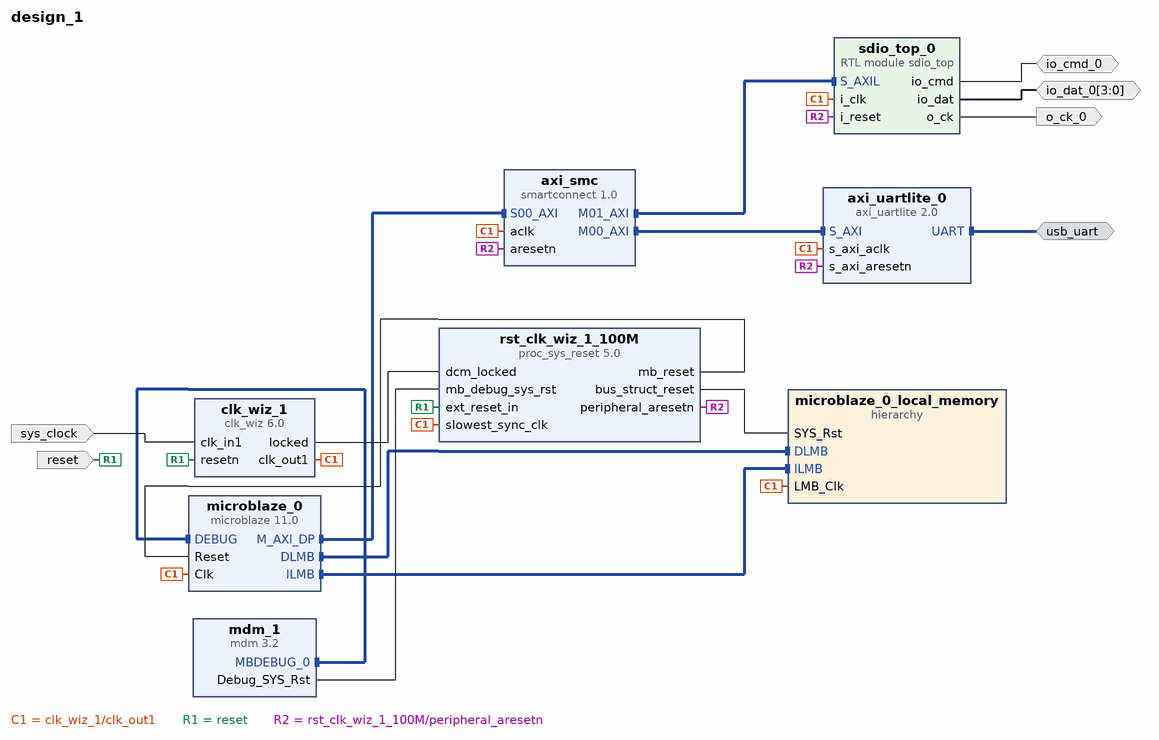
[diagram p0: block diagram of the top level]
# Vivado block design design_1, xc7a100tcsg324-1, Vivado 2025.1
create_bd_design design_1

create_bd_intf_port -mode Master -vlnv xilinx.com:interface:uart_rtl:1.0 usb_uart
create_bd_port -dir I -type clk sys_clock
set_property -dict {CONFIG.FREQ_HZ 100000000 CONFIG.PHASE 0.0} [get_bd_ports sys_clock]
create_bd_port -dir I -type rst reset
set_property -dict {CONFIG.POLARITY ACTIVE_LOW} [get_bd_ports reset]
create_bd_port -dir O o_ck_0
create_bd_port -dir IO io_cmd_0
create_bd_port -dir IO -from 3 -to 0 io_dat_0

create_bd_cell -type ip -vlnv xilinx.com:ip:microblaze:11.0 microblaze_0
set_property -dict [list \
  CONFIG.C_DEBUG_ENABLED 1 \
  CONFIG.C_D_AXI 1 \
  CONFIG.C_D_LMB 1 \
  CONFIG.C_ENABLE_CONVERSION 0 \
  CONFIG.C_I_LMB 1 \
] [get_bd_cells microblaze_0]
create_bd_cell -type hier microblaze_0_local_memory
create_bd_cell -type ip -vlnv xilinx.com:ip:mdm:3.2 mdm_1
create_bd_cell -type ip -vlnv xilinx.com:ip:clk_wiz:6.0 clk_wiz_1
set_property -dict [list \
  CONFIG.CLK_IN1_BOARD_INTERFACE sys_clock \
  CONFIG.PRIM_SOURCE Single_ended_clock_capable_pin \
  CONFIG.RESET_BOARD_INTERFACE reset \
  CONFIG.RESET_PORT resetn \
  CONFIG.RESET_TYPE ACTIVE_LOW \
  CONFIG.USE_BOARD_FLOW true \
] [get_bd_cells clk_wiz_1]
create_bd_cell -type ip -vlnv xilinx.com:ip:proc_sys_reset:5.0 rst_clk_wiz_1_100M
set_property -dict {CONFIG.RESET_BOARD_INTERFACE reset CONFIG.USE_BOARD_FLOW true} [get_bd_cells rst_clk_wiz_1_100M]
create_bd_cell -type ip -vlnv xilinx.com:ip:axi_uartlite:2.0 axi_uartlite_0
set_property -dict {CONFIG.UARTLITE_BOARD_INTERFACE usb_uart CONFIG.USE_BOARD_FLOW true} [get_bd_cells axi_uartlite_0]
create_bd_cell -type ip -vlnv xilinx.com:ip:smartconnect:1.0 axi_smc
set_property -dict {CONFIG.NUM_MI 2 CONFIG.NUM_SI 1} [get_bd_cells axi_smc]
create_bd_cell -type module -reference sdio_top sdio_top_0

# ---- hierarchy /microblaze_0_local_memory ----
current_bd_instance /microblaze_0_local_memory
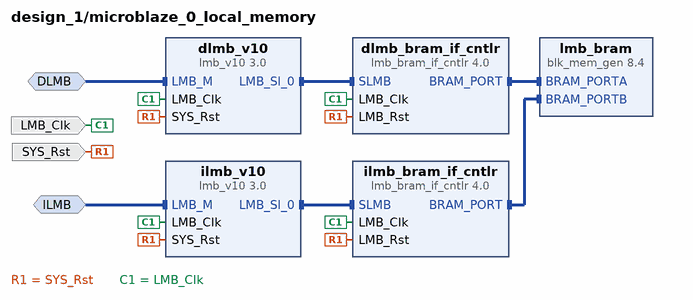
[diagram p1: block diagram inside /microblaze_0_local_memory]
create_bd_intf_pin -mode MirroredMaster -vlnv xilinx.com:interface:lmb_rtl:1.0 DLMB
create_bd_intf_pin -mode MirroredMaster -vlnv xilinx.com:interface:lmb_rtl:1.0 ILMB
create_bd_pin -dir I -type clk LMB_Clk
create_bd_pin -dir I -type rst SYS_Rst

create_bd_cell -type ip -vlnv xilinx.com:ip:lmb_v10:3.0 dlmb_v10
create_bd_cell -type ip -vlnv xilinx.com:ip:lmb_v10:3.0 ilmb_v10
create_bd_cell -type ip -vlnv xilinx.com:ip:lmb_bram_if_cntlr:4.0 dlmb_bram_if_cntlr
set_property -dict {CONFIG.C_ECC 0} [get_bd_cells dlmb_bram_if_cntlr]
create_bd_cell -type ip -vlnv xilinx.com:ip:lmb_bram_if_cntlr:4.0 ilmb_bram_if_cntlr
set_property -dict {CONFIG.C_ECC 0} [get_bd_cells ilmb_bram_if_cntlr]
create_bd_cell -type ip -vlnv xilinx.com:ip:blk_mem_gen:8.4 lmb_bram
set_property -dict {CONFIG.Memory_Type True_Dual_Port_RAM CONFIG.use_bram_block BRAM_Controller} [get_bd_cells lmb_bram]

# ---- connections ----

current_bd_instance /microblaze_0_local_memory
connect_bd_intf_net -intf_net microblaze_0_dlmb [get_bd_intf_pins dlmb_v10/LMB_M] [get_bd_intf_pins DLMB]
connect_bd_intf_net -intf_net microblaze_0_dlmb_bus [get_bd_intf_pins dlmb_v10/LMB_Sl_0] [get_bd_intf_pins dlmb_bram_if_cntlr/SLMB]
connect_bd_intf_net -intf_net microblaze_0_dlmb_cntlr [get_bd_intf_pins dlmb_bram_if_cntlr/BRAM_PORT] [get_bd_intf_pins lmb_bram/BRAM_PORTA]
connect_bd_intf_net -intf_net microblaze_0_ilmb [get_bd_intf_pins ilmb_v10/LMB_M] [get_bd_intf_pins ILMB]
connect_bd_intf_net -intf_net microblaze_0_ilmb_bus [get_bd_intf_pins ilmb_v10/LMB_Sl_0] [get_bd_intf_pins ilmb_bram_if_cntlr/SLMB]
connect_bd_intf_net -intf_net microblaze_0_ilmb_cntlr [get_bd_intf_pins ilmb_bram_if_cntlr/BRAM_PORT] [get_bd_intf_pins lmb_bram/BRAM_PORTB]
connect_bd_net [get_bd_pins SYS_Rst] \
  [get_bd_pins dlmb_v10/SYS_Rst] [get_bd_pins dlmb_bram_if_cntlr/LMB_Rst] [get_bd_pins ilmb_v10/SYS_Rst] \
  [get_bd_pins ilmb_bram_if_cntlr/LMB_Rst]
connect_bd_net -net microblaze_0_Clk [get_bd_pins LMB_Clk] \
  [get_bd_pins dlmb_v10/LMB_Clk] [get_bd_pins dlmb_bram_if_cntlr/LMB_Clk] [get_bd_pins ilmb_v10/LMB_Clk] \
  [get_bd_pins ilmb_bram_if_cntlr/LMB_Clk]
set_property HDL_ATTRIBUTE.BMM_INFO_ADDRESS_SPACE {byte  0x00000000 32 > design_1 microblaze_0_local_memory/lmb_bram} [get_bd_cells dlmb_bram_if_cntlr]
set_property HDL_ATTRIBUTE.KEEP_HIERARCHY yes [get_bd_cells dlmb_bram_if_cntlr]

current_bd_instance /
connect_bd_intf_net [get_bd_intf_pins axi_smc/M00_AXI] [get_bd_intf_pins axi_uartlite_0/S_AXI]
connect_bd_intf_net [get_bd_intf_pins axi_smc/M01_AXI] [get_bd_intf_pins sdio_top_0/S_AXIL]
connect_bd_intf_net [get_bd_intf_ports usb_uart] [get_bd_intf_pins axi_uartlite_0/UART]
connect_bd_intf_net [get_bd_intf_pins microblaze_0/M_AXI_DP] [get_bd_intf_pins axi_smc/S00_AXI]
connect_bd_intf_net [get_bd_intf_pins mdm_1/MBDEBUG_0] [get_bd_intf_pins microblaze_0/DEBUG]
connect_bd_intf_net [get_bd_intf_pins microblaze_0/DLMB] [get_bd_intf_pins microblaze_0_local_memory/DLMB]
connect_bd_intf_net [get_bd_intf_pins microblaze_0/ILMB] [get_bd_intf_pins microblaze_0_local_memory/ILMB]
connect_bd_net [get_bd_ports io_cmd_0] [get_bd_pins sdio_top_0/io_cmd]
connect_bd_net [get_bd_ports io_dat_0] [get_bd_pins sdio_top_0/io_dat]
connect_bd_net [get_bd_pins clk_wiz_1/locked] [get_bd_pins rst_clk_wiz_1_100M/dcm_locked]
connect_bd_net [get_bd_pins mdm_1/Debug_SYS_Rst] [get_bd_pins rst_clk_wiz_1_100M/mb_debug_sys_rst]
connect_bd_net -net microblaze_0_Clk [get_bd_pins clk_wiz_1/clk_out1] \
  [get_bd_pins microblaze_0/Clk] [get_bd_pins microblaze_0_local_memory/LMB_Clk] \
  [get_bd_pins rst_clk_wiz_1_100M/slowest_sync_clk] [get_bd_pins axi_smc/aclk] [get_bd_pins axi_uartlite_0/s_axi_aclk] \
  [get_bd_pins sdio_top_0/i_clk]
connect_bd_net [get_bd_ports reset] [get_bd_pins clk_wiz_1/resetn] [get_bd_pins rst_clk_wiz_1_100M/ext_reset_in]
connect_bd_net [get_bd_pins rst_clk_wiz_1_100M/bus_struct_reset] [get_bd_pins microblaze_0_local_memory/SYS_Rst]
connect_bd_net [get_bd_pins rst_clk_wiz_1_100M/mb_reset] [get_bd_pins microblaze_0/Reset]
connect_bd_net [get_bd_pins rst_clk_wiz_1_100M/peripheral_aresetn] \
  [get_bd_pins axi_uartlite_0/s_axi_aresetn] [get_bd_pins axi_smc/aresetn] [get_bd_pins sdio_top_0/i_reset]
connect_bd_net [get_bd_pins sdio_top_0/o_ck] [get_bd_ports o_ck_0]
connect_bd_net [get_bd_ports sys_clock] [get_bd_pins clk_wiz_1/clk_in1]
set_property HDL_ATTRIBUTE.BMM_INFO_PROCESSOR {microblaze-le > design_1 microblaze_0_local_memory/dlmb_bram_if_cntlr} [get_bd_cells microblaze_0]
set_property HDL_ATTRIBUTE.KEEP_HIERARCHY yes [get_bd_cells microblaze_0]

# ---- address map ----
assign_bd_address -offset 0x00000000 -range 128K -target_address_space [get_bd_addr_spaces microblaze_0/Data] [get_bd_addr_segs microblaze_0_local_memory/dlmb_bram_if_cntlr/SLMB/Mem]
assign_bd_address -offset 0x00020000 -range 4K -target_address_space [get_bd_addr_spaces microblaze_0/Data] [get_bd_addr_segs sdio_top_0/S_AXIL/reg0]
assign_bd_address -offset 0x40600000 -range 64K -target_address_space [get_bd_addr_spaces microblaze_0/Data] [get_bd_addr_segs axi_uartlite_0/S_AXI/Reg]
assign_bd_address -offset 0x00000000 -range 128K -target_address_space [get_bd_addr_spaces microblaze_0/Instruction] [get_bd_addr_segs microblaze_0_local_memory/ilmb_bram_if_cntlr/SLMB/Mem]

validate_bd_design
save_bd_design
